# Altium project StereoCameraV2.PrjPCB
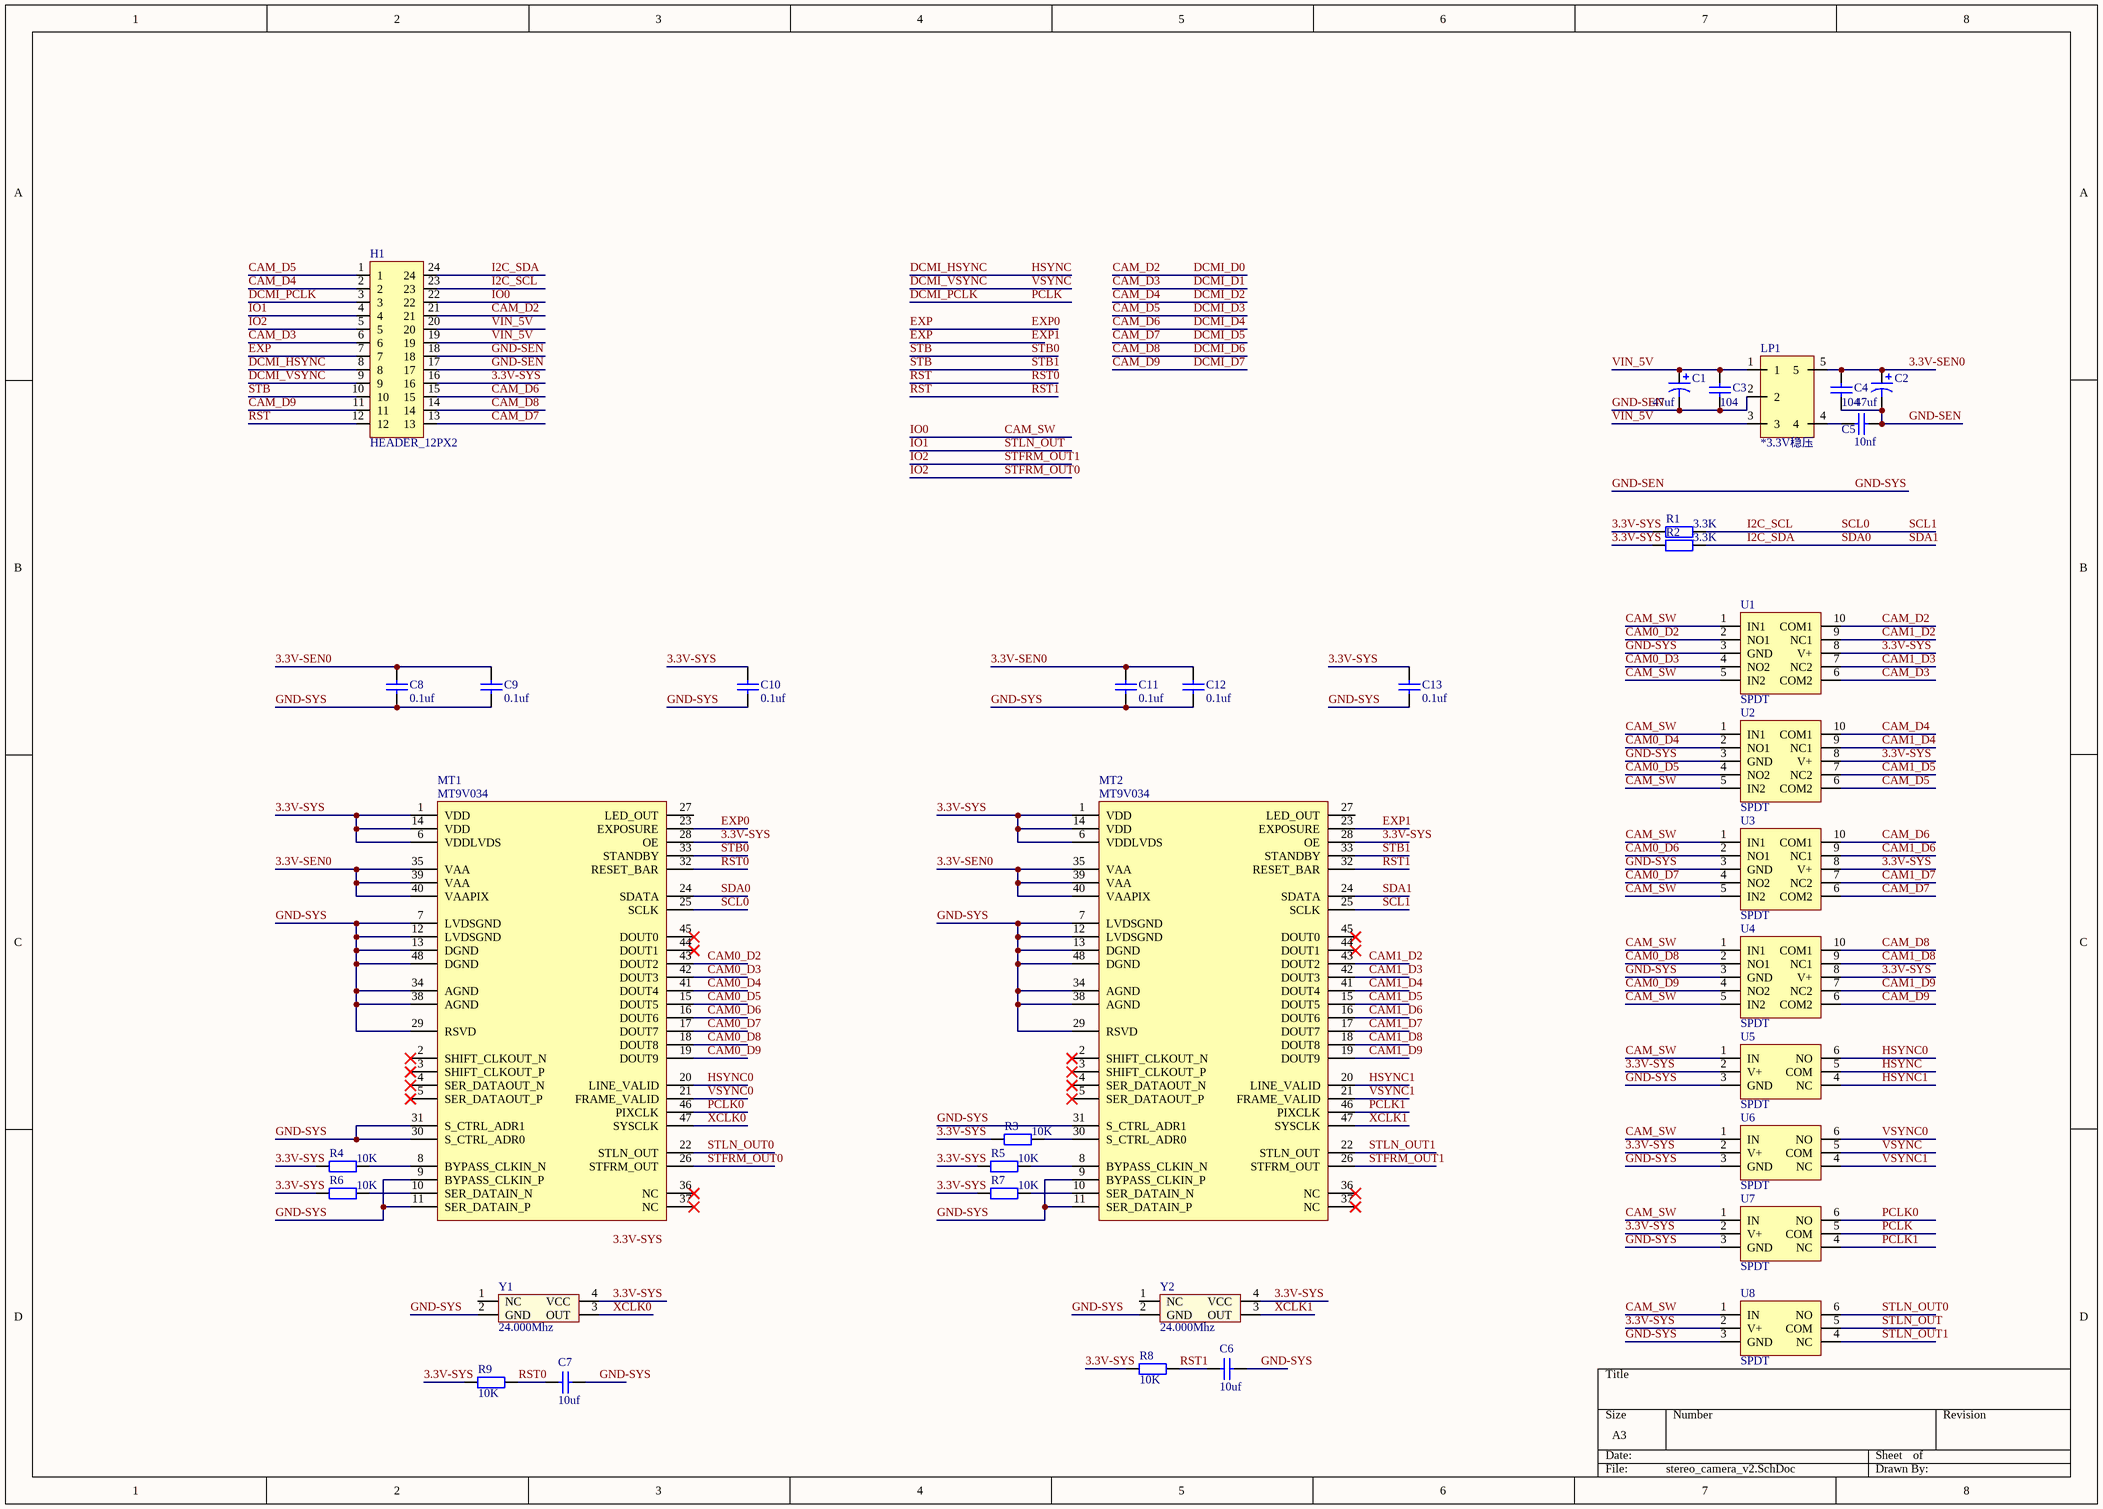
[diagram p0: stereo_camera_v2.SchDoc]
1 sheet, 36 parts. Net scope: global (net labels, ports and power ports of the same name join across sheets).
Board file: stereo_camera_v2.PcbDoc

## Sheet stereo_camera_v2.SchDoc
size A3

### Parts
C1  47uf  [3225_C]
C2  47uf  [3225_C]
C3  value 104  [C0402]  (hidden comment: Cap)
C4  value 104  [C0402]  (hidden comment: Cap)
C5  value 10nf  [C0402]  (hidden comment: Cap)
C6  10uf  [C0402]
C7  10uf  [C0402]
C8  0.1uf  [C0402]
C9  0.1uf  [C0402]
C10  0.1uf  [C0402]
C11  0.1uf  [C0402]
C12  0.1uf  [C0402]
C13  0.1uf  [C0402]
H1  HEADER_12PX2  [松下AXE-24PIN-0.4mm-header]
LP1  *3.3V稳压  [SOT23-5]
MT1  MT9V034  [CLCC_48]
MT2  MT9V034  [CLCC_48]
R1  value 3.3K  [R0402]  (hidden comment: Res2)
R2  value 3.3K  [R0402]  (hidden comment: Res2)
R3  value 10K  [R0402]  (hidden comment: Res2)
R4  value 10K  [R0402]  (hidden comment: Res2)
R5  value 10K  [R0402]  (hidden comment: Res2)
R6  value 10K  [R0402]  (hidden comment: Res2)
R7  value 10K  [R0402]  (hidden comment: Res2)
R8  10K  [R0402]
R9  10K  [R0402]
U1  SPDT  [MSOP-10]
U2  SPDT  [MSOP-10]
U3  SPDT  [MSOP-10]
U4  SPDT  [MSOP-10]
U5  SPDT  [SC70-6]
U6  SPDT  [SC70-6]
U7  SPDT  [SC70-6]
U8  SPDT  [SC70-6]
Y1  24.000Mhz  [X3225]
Y2  24.000Mhz  [X3225]

### Nets
3.3V-SEN0: C2.1 C4.1 C8.1 C9.1 C11.1 C12.1 LP1.5 MT1.35(VAA) MT1.39(VAA) MT1.40(VAAPIX) MT2.35(VAA) MT2.39(VAA) MT2.40(VAAPIX)
3.3V-SYS: C10.1 C13.1 H1.16 MT1.1(VDD) MT1.6(VDDLVDS) MT1.14(VDD) MT1.28(OE) MT2.1(VDD) MT2.6(VDDLVDS) MT2.14(VDD) MT2.28(OE) R1.2 R2.2 R3.2 R4.2 R5.2 R6.2 R7.2 R8.1 R9.1 U1.8(V+) U2.8(V+) U3.8(V+) U4.8(V+) U5.2(V+) U6.2(V+) U7.2(V+) U8.2(V+) Y1.4(VCC) Y2.4(VCC)
CAM0_D2: MT1.43(DOUT2) U1.2(NO1)
CAM0_D3: MT1.42(DOUT3) U1.4(NO2)
CAM0_D4: MT1.41(DOUT4) U2.2(NO1)
CAM0_D5: MT1.15(DOUT5) U2.4(NO2)
CAM0_D6: MT1.16(DOUT6) U3.2(NO1)
CAM0_D7: MT1.17(DOUT7) U3.4(NO2)
CAM0_D8: MT1.18(DOUT8) U4.2(NO1)
CAM0_D9: MT1.19(DOUT9) U4.4(NO2)
CAM1_D2: MT2.43(DOUT2) U1.9(NC1)
CAM1_D3: MT2.42(DOUT3) U1.7(NC2)
CAM1_D4: MT2.41(DOUT4) U2.9(NC1)
CAM1_D5: MT2.15(DOUT5) U2.7(NC2)
CAM1_D6: MT2.16(DOUT6) U3.9(NC1)
CAM1_D7: MT2.17(DOUT7) U3.7(NC2)
CAM1_D8: MT2.18(DOUT8) U4.9(NC1)
CAM1_D9: MT2.19(DOUT9) U4.7(NC2)
CAM_D2: H1.21 U1.10(COM1)  [also labelled DCMI_D0]
CAM_D3: H1.6 U1.6(COM2)  [also labelled DCMI_D1]
CAM_D4: H1.2 U2.10(COM1)  [also labelled DCMI_D2]
CAM_D5: H1.1 U2.6(COM2)  [also labelled DCMI_D3]
CAM_D6: H1.15 U3.10(COM1)  [also labelled DCMI_D4]
CAM_D7: H1.13 U3.6(COM2)  [also labelled DCMI_D5]
CAM_D8: H1.14 U4.10(COM1)  [also labelled DCMI_D6]
CAM_D9: H1.11 U4.6(COM2)  [also labelled DCMI_D7]
CAM_SW: H1.22 U1.1(IN1) U1.5(IN2) U2.1(IN1) U2.5(IN2) U3.1(IN1) U3.5(IN2) U4.1(IN1) U4.5(IN2) U5.1(IN) U6.1(IN) U7.1(IN) U8.1(IN)  [also labelled IO0]
DCMI_HSYNC: H1.8 U5.5(COM)  [also labelled HSYNC]
DCMI_PCLK: H1.3 U7.5(COM)  [also labelled PCLK]
DCMI_VSYNC: H1.9 U6.5(COM)  [also labelled VSYNC]
EXP: H1.7 MT1.23(EXPOSURE) MT2.23(EXPOSURE)  [also labelled EXP0, EXP1]
GND-SEN: C1.2 C2.2 C3.1 C4.2 C5.1 C6.1 C7.2 C8.2 C9.2 C10.2 C11.2 C12.2 C13.2 H1.17 H1.18 LP1.2 MT1.7(LVDSGND) MT1.9(BYPASS_CLKIN_P) MT1.11(SER_DATAIN_P) MT1.12(LVDSGND) MT1.13(DGND) MT1.29(RSVD) MT1.30(S_CTRL_ADR0) MT1.31(S_CTRL_ADR1) MT1.34(AGND) MT1.38(AGND) MT1.48(DGND) MT2.7(LVDSGND) MT2.9(BYPASS_CLKIN_P) MT2.11(SER_DATAIN_P) MT2.12(LVDSGND) MT2.13(DGND) MT2.29(RSVD) MT2.31(S_CTRL_ADR1) MT2.34(AGND) MT2.38(AGND) MT2.48(DGND) U1.3(GND) U2.3(GND) U3.3(GND) U4.3(GND) U5.3(GND) U6.3(GND) U7.3(GND) U8.3(GND) Y1.2(GND) Y2.2(GND)  [also labelled GND-SYS]
HSYNC0: MT1.20(LINE_VALID) U5.6(NO)
HSYNC1: MT2.20(LINE_VALID) U5.4(NC)
I2C_SCL: H1.23 MT1.25(SCLK) MT2.25(SCLK) R1.1  [also labelled SCL0, SCL1]
I2C_SDA: H1.24 MT1.24(SDATA) MT2.24(SDATA) R2.1  [also labelled SDA0, SDA1]
IO1: H1.4 U8.5(COM)  [also labelled STLN_OUT]
IO2: H1.5 MT1.26(STFRM_OUT) MT2.26(STFRM_OUT)  [also labelled STFRM_OUT0, STFRM_OUT1]
PCLK0: MT1.46(PIXCLK) U7.6(NO)
PCLK1: MT2.46(PIXCLK) U7.4(NC)
RST: C6.2 C7.1 H1.12 MT1.32(RESET_BAR) MT2.32(RESET_BAR) R8.2 R9.2  [also labelled RST0, RST1]
STB: H1.10 MT1.33(STANDBY) MT2.33(STANDBY)  [also labelled STB0, STB1]
STLN_OUT0: MT1.22(STLN_OUT) U8.6(NO)
STLN_OUT1: MT2.22(STLN_OUT) U8.4(NC)
VIN_5V: C1.1 C3.2 H1.19 H1.20 LP1.1 LP1.3
VSYNC0: MT1.21(FRAME_VALID) U6.6(NO)
VSYNC1: MT2.21(FRAME_VALID) U6.4(NC)
XCLK0: MT1.47(SYSCLK) Y1.3(OUT)
XCLK1: MT2.47(SYSCLK) Y2.3(OUT)
NetC5_2: C5.2 LP1.4
NetMT1_8: MT1.8(BYPASS_CLKIN_N) R4.1
NetMT1_10: MT1.10(SER_DATAIN_N) R6.1
NetMT2_8: MT2.8(BYPASS_CLKIN_N) R5.1
NetMT2_10: MT2.10(SER_DATAIN_N) R7.1
NetMT2_30: MT2.30(S_CTRL_ADR0) R3.1

Not connected (* = marked no-connect by the designer): MT1 2(SHIFT_CLKOUT_N)* 3(SHIFT_CLKOUT_P)* 4(SER_DATAOUT_N)* 5(SER_DATAOUT_P)* 27(LED_OUT) 36(NC)* 37(NC)* 44(DOUT1)* 45(DOUT0)*; MT2 2(SHIFT_CLKOUT_N)* 3(SHIFT_CLKOUT_P)* 4(SER_DATAOUT_N)* 5(SER_DATAOUT_P)* 27(LED_OUT) 36(NC)* 37(NC)* 44(DOUT1)* 45(DOUT0)*; Y1 1(NC); Y2 1(NC)

### Notes on the sheet
- Labels drawn without touching a wire or pin: 3.3V-SYS

### Library data of the parts
C1 C2 = cap_pn
C3-C5 = Cap: Capacitor; Published: 8-Jun-2000; LatestRevisionDate: 17-Jul-2002; LatestRevisionNote: Re-released for DXP Platform.; PackageReference: RAD-0.3; Publisher: Altium Limited; PackageDescription: Radial Cap, Thru-Hole; 2 Leads; 0.3 in Pin Spacing
C6-C13 = CAP
LP1 = LP2985
MT1 MT2 = MT9V034: CMOS; PartNumber: MT9V034C12STM-DP1
R1-R7 = Res2: Resistor; Published: 8-Jun-2000; LatestRevisionDate: 17-Jul-2002; LatestRevisionNote: Re-released for DXP Platform.; PackageReference: AXIAL-0.4; Publisher: Altium Limited; PackageDescription: Axial Device, Thru-Hole; 2 Leads; 0.4 in Pin Spacing
R8 R9 = RES
U1-U4 = sgm3002: analog switch
U5-U8 = sgm3001: analog switch
Y1 Y2 = XTAL_S: 有源晶振